# Altium project LightControlDevice.PrjPcb
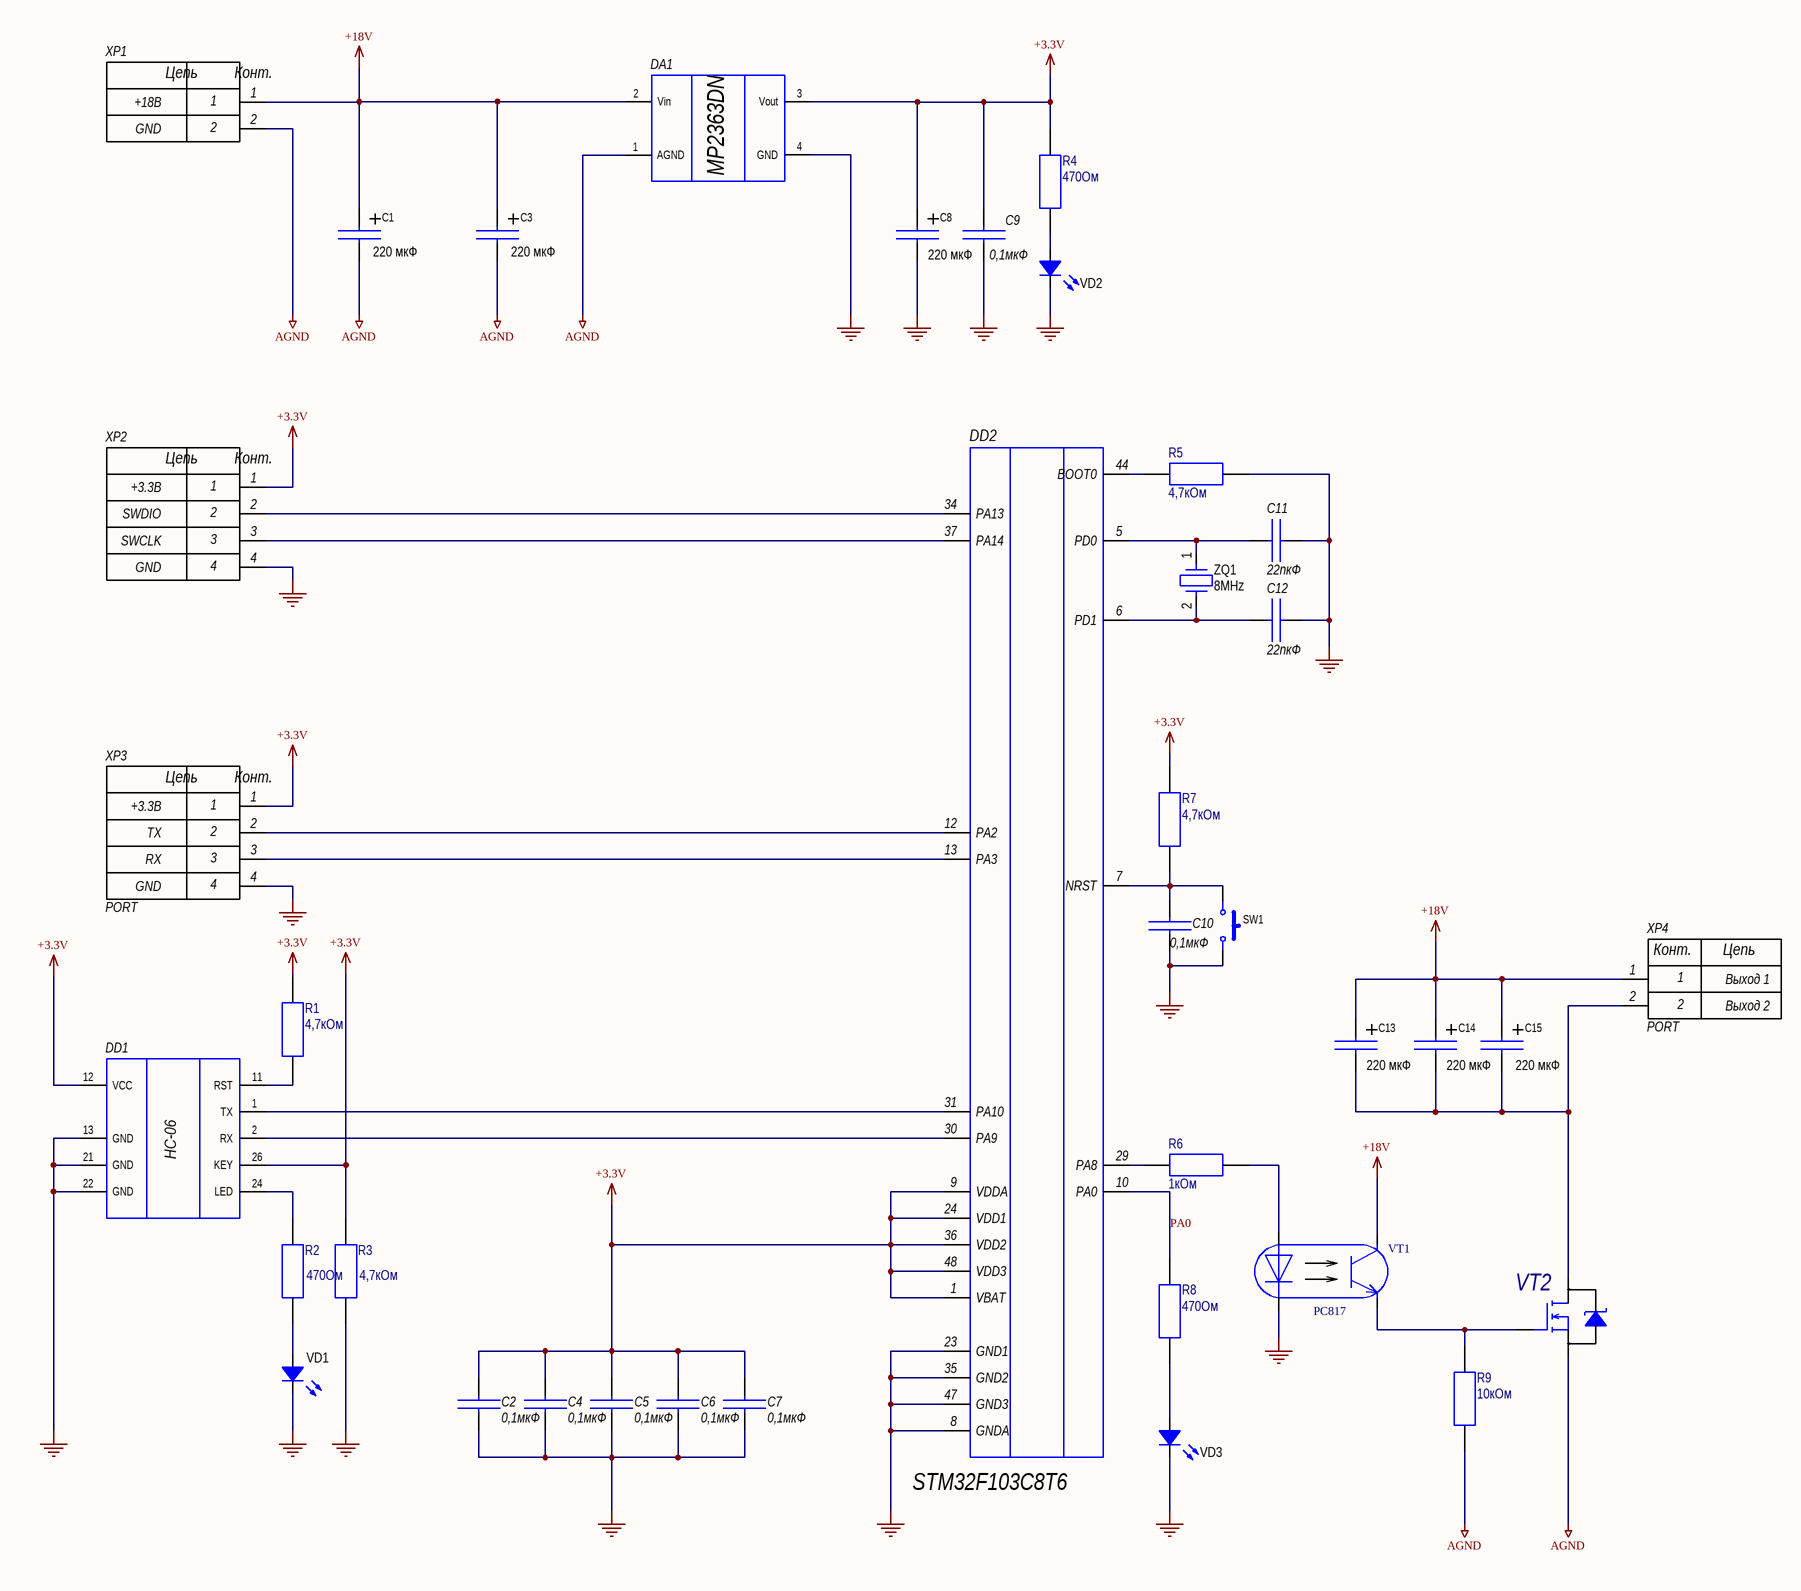
[diagram p0: Schematic.SchDoc]
1 sheet, 38 parts. Net scope: global (net labels, ports and power ports of the same name join across sheets).
Board file: pbcBoard.PcbDoc

## Sheet Schematic.SchDoc
size A2

### Parts
C1  value 220 мкФ  [chip_25V_220uF]  (hidden comment: 220uF_25V_chip)
C2  value 0,1мкФ  [CAP: SMD0805]  (hidden comment: SMD0805)
C3  value 220 мкФ  [chip_25V_220uF]  (hidden comment: 220uF_25V_chip)
C4  value 0,1мкФ  [CAP: SMD0805]  (hidden comment: SMD0805)
C5  value 0,1мкФ  [CAP: SMD0805]  (hidden comment: SMD0805)
C6  value 0,1мкФ  [CAP: SMD0805]  (hidden comment: SMD0805)
C7  value 0,1мкФ  [CAP: SMD0805]  (hidden comment: SMD0805)
C8  value 220 мкФ  [chip_25V_220uF]  (hidden comment: 220uF_25V_chip)
C9  value 0,1мкФ  [CAP: SMD0805]  (hidden comment: SMD0805)
C10  value 0,1мкФ  [CAP: SMD0805]  (hidden comment: SMD0805)
C11  value 22пкФ  [CAP: SMD0805]  (hidden comment: SMD0805)
C12  value 22пкФ  [CAP: SMD0805]  (hidden comment: SMD0805)
C13  value 220 мкФ  [chip_25V_220uF]  (hidden comment: 220uF_25V_chip)
C14  value 220 мкФ  [chip_25V_220uF]  (hidden comment: 220uF_25V_chip)
C15  value 220 мкФ  [chip_25V_220uF]  (hidden comment: 220uF_25V_chip)
DA1  MP2363DN  [MP2363DN]
DD1  HC-06  [HC-06]
DD2  STM32F103C8T6  [LQFP48_N]
R1  4,7кОм  [RES: SMD0805]
R2  470Ом  [RES: SMD0805]
R3  4,7кОм  [RES: SMD0805]
R4  470Ом  [RES: SMD0805]
R5  4,7кОм  [RES: SMD0805]
R6  1кОм  [RES: SMD0805]
R7  4,7кОм  [RES: SMD0805]
R8  470Ом  [RES: SMD0805]
R9  10кОм  [RES: SMD0805]
SW1  SWITCH  [KLS76x6x4.3]  (value not drawn)
VD1  RED  [LED0805]  (value not drawn)
VD2  RED  [LED0805]  (value not drawn)
VD3  RED  [LED0805]  (value not drawn)
VT1  PC817  [DIP4_SMD_PC817]
VT2  IRF540  [IRF540_D2Pak]  (value not drawn)
XP1  PORT  [DJK-02A]  (value not drawn)
XP2  PORT  [ph2.0-4P]  (value not drawn)
XP3  PORT  [ph2.0-4P]
XP4  PORT  [DJK-02A]
ZQ1  8MHz  [HC-49SM]

### Nets
+3.3V: C2.2 C4.2 C5.2 C6.2 C7.2 C8.1 C9.2 DA1.3(Vout) DD1.12(VCC) DD1.26(KEY) DD2.1(VBAT) DD2.9(VDDA) DD2.24(VDD1) DD2.36(VDD2) DD2.48(VDD3) R1.2 R3.2 R4.2 R7.2 XP2.1(+3.3B) XP3.1(+3.3B)
+18V: C1.1 C3.1 C13.1 C14.1 C15.1 DA1.2(Vin) VT1.4(К) XP1.1(+18B) XP4.1(Выход_1)
AGND: C1.2 C3.2 DA1.1(AGND) R9.1 VT2.3(S) XP1.2(GND)
GND: C2.1 C4.1 C5.1 C6.1 C7.1 C8.2 C9.1 C10.1 C11.2 C12.2 DA1.4(GND) DD1.13(GND) DD1.21(GND) DD1.22(GND) DD2.8(GNDA) DD2.23(GND1) DD2.35(GND2) DD2.47(GND3) R3.1 R5.2 SW1.2 VD1.2(K) VD2.2(K) VD3.2(K) VT1.2(K) XP2.4(GND) XP3.4(GND)
PA0: DD2.10(PA0) R8.2
NetC10_2: C10.2 DD2.7(NRST) R7.1 SW1.1
NetC11_1: C11.1 DD2.5(PD0) ZQ1.1
NetC12_1: C12.1 DD2.6(PD1) ZQ1.2
NetC13_2: C13.2 C14.2 C15.2 VT2.2(D) XP4.2(Выход_2)
NetDD1_1: DD1.1(TX) DD2.31(PA10)
NetDD1_2: DD1.2(RX) DD2.30(PA9)
NetDD1_11: DD1.11(RST) R1.1
NetDD1_24: DD1.24(LED) R2.2
NetDD2_12: DD2.12(PA2) XP3.2(TX)
NetDD2_13: DD2.13(PA3) XP3.3(RX)
NetDD2_29: DD2.29(PA8) R6.2
NetDD2_34: DD2.34(PA13) XP2.2(SWDIO)
NetDD2_37: DD2.37(PA14) XP2.3(SWCLK)
NetDD2_44: DD2.44(BOOT0) R5.1
NetR2_1: R2.1 VD1.1(A)
NetR4_1: R4.1 VD2.1(A)
NetR6_1: R6.1 VT1.1(A)
NetR8_1: R8.1 VD3.1(A)
NetR9_2: R9.2 VT1.3(Э) VT2.1(G)

### Notes on the sheet
- (in symbol PH2.0-2P_XS1) Цепь; Конт.
- (in symbol PH2.0-2P_XS2) Конт.; Цепь
- (in symbol PH2.0-4P_XP1) Цепь; Конт.
- (in symbol PH2.0-4P_XP2) Цепь; Конт.

### Library data of the parts
C2 C4-C7 C9-C12 = SMD0805: CAP
DA1 = MP2363DN: Преобразователь напряжения
DD2 = STM32F103C8T6(Dinara): A/D Converter: 2x12-bit (10 Channel); Core: ARM Cortex-M3; FLASH Size (Prog) (kB): 64; I/Os (High Current): 37; Internal RAM Size (kB): 20; Operating Frequency(F) (Processor speed) (MHz): 72; Packing: Tray; Supply Voltage(Vcc) min (V): 2; DatasheetVersion: Rev. 16; PackageVersion: Rev. 6, 06/2013; PackageReference: LQFP48; PackageDescription: 48-Pin Low Profile Quad Flat Package, 7 x 7 mm Body, 0.5 mm Pitch; Supplier 1: Digi-Key; Supplier Part Number 1: 497-6063-ND; Supplier 2: Farnell; Supplier Part Number 2: 1447637; Supplier 3: Newark; Supplier Part Number 3: 59M2182; Supplier 4: Newark; Supplier Part Number 4: 57P1222; Supplier 5: Mouser; Supplier Part Number 5: 511-STM32F103C8T6; Mounting Technology: Surface Mount; PartNumber: STM32F103C8T6; ComponentLink1Description: Manufacturer URL; ComponentLink1URL: http://www.st.com/web/en/home.html; ComponentLink2Description: Datasheet; ComponentLink2URL: http://www.st.com/st-web-ui/static/active/en/resource/technical/document/datasheet/CD00161566.pdf; ComponentLink3Description: Package Specification; ComponentLink3URL: http://www.st.com/st-web-ui/static/active/en/resource/technical/document/datasheet/DM00058181.pdf
R1-R9 = SMD0805
VD1-VD3 = diode_led
VT2 = IRF540: Type: Транзистор; Published: 10.02.2014; Publisher: Andrew Danich
XP1 = PH2.0-2P_XS1
XP2 = PH2.0-4P_XP1
XP3 = PH2.0-4P_XP2
XP4 = PH2.0-2P_XS2
ZQ1 = HC-49
DD1 = HC-06: ComponentLink1Description: Datasheet; ComponentLink1URL: http://www.farnell.com/datasheets/2236920.pdf
SW1 = SWITCH: ComponentLink1Description: AliExpress; ComponentLink1URL: https://ru.aliexpress.com/item/10PCS-4-4-1-6mm-4x4x1-6H-SMD-push-button-switch-microswitch-Tact-Switch/32731081870.html?spm=a2g0s.9042311.0.0.250233edGDnBBV